# Altium schematic sheet AdjustableLDO.SchDoc
size A3; SheetNumber: 2; SheetTotal: 6
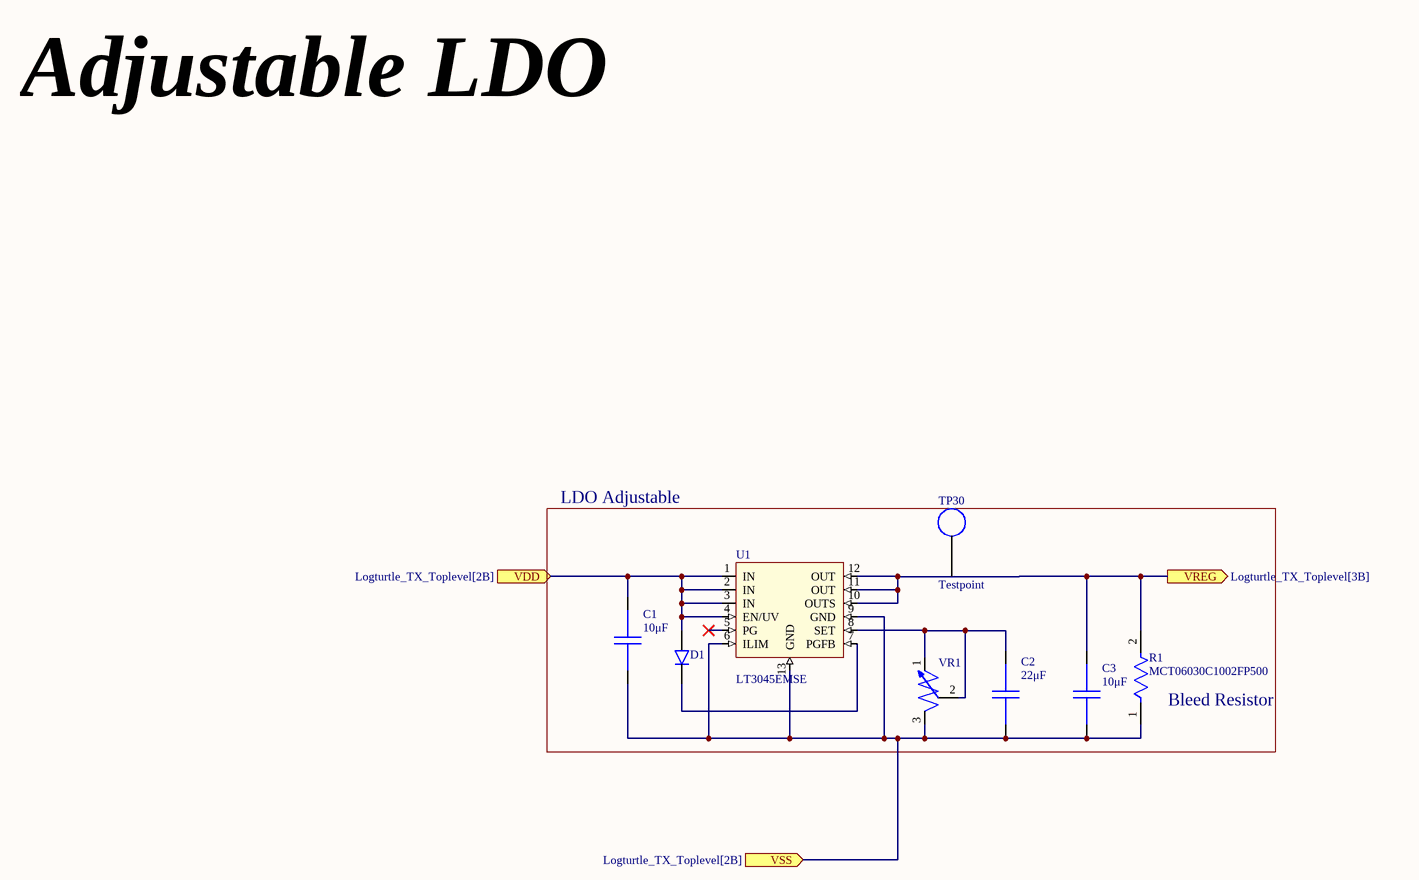
[diagram p0: AdjustableLDO.SchDoc]

## Parts
C1  10μF  [CAPC2012X14N]
C2  22μF  [CAPC3225X27N]
C3  10μF  [CAPC2012X14N]
D1  (no value)  [SODFL160X70-2N]
R1  MCT06030C1002FP500  [FP-MCT0603-IPC_C]
TP30  Testpoint  [TP_5006]
U1  LT3045EMSE  [TSOP65P490X110_HS-13N]
VR1  (no value)  [3296W]

## Ports
VDD (in, see Logturtle_TX_Toplevel[2B]), VREG (out, see Logturtle_TX_Toplevel[3B]), VSS (in, see Logturtle_TX_Toplevel[2B])

## Nets
VDD: C1.2 D1.1(Anode) U1.1(IN) U1.2(IN) U1.3(IN) U1.4(EN/UV) ; port VDD
VREG: C3.2 R1.2 TP30.1 U1.10(OUTS) U1.11(OUT) U1.12(OUT) ; port VREG
VSS: C1.1 C2.1 C3.1 R1.1 U1.6(ILIM) U1.9(GND) U1.13(GND) VR1.3 ; port VSS
NetC2_2: C2.2 U1.8(SET) VR1.1(CW) VR1.2(CCW)
NetD1_2: D1.2(Cathode) U1.7(PGFB)

Not connected (* = marked no-connect by the designer): U1 5(PG)*

## Notes on the sheet
- Adjustable LDO
- LDO Adjustable
- (near R1) Bleed Resistor

## Library data of the parts
C1 C3 = GRM21BZ71E106KE15L: Multilayer Ceramic Capacitor, 10 uF, 25 V, ï¿½ 10%, X7R, 0805 [2012 Metric] https://www.digikey.ie/en/products/detail/murata-electronics/GRM21BZ71E106KE15L/13904911; Manufacturer: Murata; Material: 4241ConductorMaterial; Value: 10uF; Voltage Rating: 25V; Supplier: Future Electronics; Supplier Part Number: 6134628; Manufacturer Part Number: GRM21BZ71E106KE15L; Category: Ceramic Capacitors; Stock: 81000; Case/Package: 339Case; Min Operating Temperature: -55°C; Max Operating Temperature: 125°C; Tolerance: 10%; Length: 2mm; Width: 1.25mm; Height: 1.45mm; Thickness: 1.25mm; RoHS Compliant: Yes; ComponentLink1URL: https://datasheet.octopart.com/GRM21BZ71E106KE15L-Murata-datasheet-141278873.pdf?src-supplier=Geoflip; ComponentLink1Description: https://datasheet.octopart.com/GRM21BZ71E106KE15L-Murata-datasheet-141278873.pdf?src-supplier=Geoflip; ComponentLink2URL: https://datasheet.octopart.com/GRM21BZ71E106KE15L-Murata-datasheet-165579666.pdf?src-supplier=TME; ComponentLink2Description: https://datasheet.octopart.com/GRM21BZ71E106KE15L-Murata-datasheet-165579666.pdf?src-supplier=TME; ComponentLink3URL: https://datasheet.octopart.com/GRM21BZ71E106KE15L-Murata-datasheet-140707837.pdf?src-supplier=Ciiva+Crawler; ComponentLink3Description: https://datasheet.octopart.com/GRM21BZ71E106KE15L-Murata-datasheet-140707837.pdf?src-supplier=Ciiva+Crawler; ComponentLink4URL: https://datasheet.octopart.com/GRM21BZ71E106KE15L-Murata-datasheet-138745134.pdf?src-supplier=Ciiva+Crawler; ComponentLink4Description: https://datasheet.octopart.com/GRM21BZ71E106KE15L-Murata-datasheet-138745134.pdf?src-supplier=Ciiva+Crawler
C2 = CC1210KKX7R7BB226: Ceramic Capacitor, Multilayer, Ceramic, 16V, 10% +Tol, 10% -Tol, X7R, 15% TC, 22uF, Surface Mount, 1210 https://www.digikey.ie/en/products/detail/yageo/CC1210KKX7R7BB226/5195434; Manufacturer: Yageo; Multilayer: Yes; Supplier: Rs; Supplier Part Number: 1992345; Manufacturer Part Number: CC1210KKX7R7BB226; RoHS: Yes; Category: Ceramic Capacitors; Stock: 1770; Pricing: 10=0.332, 100=0.248, 500=0.216, 1000=0.198 (EUR); Mounting Technology: Surface Mount; Pins: 2; Dielectric Material: Ceramic; Package Shape: Rectangular; Case/Package: 1210; Terminal Finish: Nickel; Min Operating Temperature: -55°C; Max Operating Temperature: 125°C; JESD-609 Code: e3; Value: 22uF; Capacitor Type: Ceramic; Tolerance  (fill in as +-): 10%; Package Style: SMTMeter; Packaging: Tape and Reel; Tolerance (fill in as +-): 10%; Rated DC Voltage (URdc): 16V; Temperature Characteristics Code: X7R; Termination: Wraparound; Length: 3.2mm; Width: 2.5mm; Height: 2.5mm; Reach SVHC Compliant: Yes; RoHS Compliant: Yes; ComponentLink1URL: https://datasheet.ciiva.com:443/pdfs/VipMasterIC/IC/YAGO/YAGO-S-A0003557223/YAGO-S-A0003557223-1.pdf?src-supplier=IHS+Markit; ComponentLink1Description: https://datasheet.ciiva.com:443/pdfs/VipMasterIC/IC/YAGO/YAGO-S-A0003557223/YAGO-S-A0003557223-1.pdf?src-supplier=IHS+Markit; ComponentLink2URL: https://datasheet.ciiva.com/11465/upy-gphc-x7r-6-3v-to-50v-8-11465512.pdf?src-supplier=Avnet; ComponentLink2Description: https://datasheet.ciiva.com/11465/upy-gphc-x7r-6-3v-to-50v-8-11465512.pdf?src-supplier=Avnet
D1 = 1N4148WT: Rectifier Diode, 1 Phase, 1 Element, 0.3A, 75V V(RRM), Silicon https://www.digikey.ie/en/products/detail/onsemi/1N4148WT/1954014; Manufacturer: ON Semiconductor / Fairchild; Supplier: Rs; Supplier Part Number: 7614283P; Manufacturer Part Number: 1N4148WT; RoHS: Yes; Category: Rectifier Diodes; Stock: 67900; Pricing: 500=0.029, 1000=0.025, 2500=0.022 (EUR); Diode Type: RECTIFIER; RoHS Compliant: Yes; ComponentLink1URL: https://datasheet.ciiva.com/16744/1n4148wt-16744972.pdf?src-supplier=Future+Electronics; ComponentLink1Description: https://datasheet.ciiva.com/16744/1n4148wt-16744972.pdf?src-supplier=Future+Electronics; ComponentLink2URL: https://datasheet.ciiva.com/30479/0900766b810e1cd4-30479226.pdf?src-supplier=Rs; ComponentLink2Description: https://datasheet.ciiva.com/30479/0900766b810e1cd4-30479226.pdf?src-supplier=Rs; ComponentLink3URL: https://datasheet.ciiva.com/15208/getdatasheetpartid-146392-15208359.pdf?src-supplier=Verical; ComponentLink3Description: https://datasheet.ciiva.com/15208/getdatasheetpartid-146392-15208359.pdf?src-supplier=Verical; ComponentLink4URL: https://datasheet.ciiva.com/916/1n914bwt-916865.pdf?src-supplier=Digikey; ComponentLink4Description: https://datasheet.ciiva.com/916/1n914bwt-916865.pdf?src-supplier=Digikey; ComponentLink5URL: https://datasheet.ciiva.com/916/1n914bwt-916866.pdf?src-supplier=Digikey; ComponentLink5Description: https://datasheet.ciiva.com/916/1n914bwt-916866.pdf?src-supplier=Digikey; ComponentLink6URL: https://datasheet.ciiva.com/916/1n914bwt-916864.pdf?src-supplier=Digikey; ComponentLink6Description: https://datasheet.ciiva.com/916/1n914bwt-916864.pdf?src-supplier=Digikey
R1 = CMP-02407-000418-1: RES SMD 100 OHM 1% 1/8W 0603; Voltage Rating: 75V; Power Rating: 100mW; Temperature Coefficient: 50ppm/°C; Max Power Dissipation: 125mW; Resistance: 10kR; Case/Package: 0603; Military Standard: Not; Min Operating Temperature: -55°C; Width: 0.8mm; Package Quantity: 1; Max Operating Temperature: 125°C; Tolerance: 1%; Depth: 0.85mm; Radiation Hardening: No; Mount: Surface Mount; Composition: Thin Film; Contact Plating: Tin; Lead Free: Lead Free; Case Code (Imperial): 0603; Number of Terminations: 2; Voltage Rating (DC): 75V; Length: 1.55mm; Packaging: Tape and Reel; Height: 0.022inch; Case Code (Metric): 1608
U1 = LT3045EMSE: 20V, 500mA, Ultralow Noise, Ultrahigh PSRR Linear Regulator  https://www.digikey.ie/en/products/detail/analog-devices-inc/LT3045EMSE-PBF/6234771
VR1 = 3296W-1-203LF: Trimmer, Cermet, 0.5W, 20000ohm, 300V, 10% +/-Tol, 100ppm/Cel, 25 Turn(s) https://www.bourns.com/docs/product-datasheets/3296.pdf; Manufacturer: Bourns; Actuator Orientation: Vertical; Actuator Type: SCREW; Number of Turns: 25; Power: 500mW; Rated Temperature: 70°C; Value: 20kR; Resistance Law: Linear; Rotational Angle: 9000°; Temperature Coefficient: -100100ppm/°C; Lead Diameter: 0.51mm; Lead Length: 6.4mm; Package Height: 10.03mm; Package Length: 9.53mm; Package Width: 4.83mm; Supplier: Digikey; Supplier Part Number: 3296W-203LF-ND; Manufacturer Part Number: 3296W-1-203LF; RoHS: Yes; Category: Variable Resistors and Potentiometers; Stock: 2018; Mounting Technology: Through Hole; Pins: 3; Package Shape: Rectangular; Case/Package: 3819; Terminal Finish: Tin; Min Operating Temperature: -55°C; Max Operating Temperature: 125°C; Tolerance: 10%; JESD-609 Code: e3; Resistor Type: TRIMMER; Construction: Trimmer Pot; Package Style: PCB MountMeter; Packaging: Rail/Tube; Technology: CERMET; Termination: Wire; RoHS Compliant: Yes; Reach SVHC Compliant: No; ComponentLink1URL: https://datasheet.ciiva.com:443/pdfs/VipMasterIC/IC/BOUR/BOUR-S-A0008796795/BOUR-S-A0008796795-1.pdf?src-supplier=IHS+Markit; ComponentLink1Description: https://datasheet.ciiva.com:443/pdfs/VipMasterIC/IC/BOUR/BOUR-S-A0008796795/BOUR-S-A0008796795-1.pdf?src-supplier=IHS+Markit; ComponentLink2URL: https://datasheet.ciiva.com/14173/ew3296-dat-e-14173023.pdf?src-supplier=Distrelec; ComponentLink2Description: https://datasheet.ciiva.com/14173/ew3296-dat-e-14173023.pdf?src-supplier=Distrelec; ComponentLink3URL: https://datasheet.ciiva.com/15156/getdatasheetpartid-62506-15156343.pdf?src-supplier=Verical; ComponentLink3Description: https://datasheet.ciiva.com/15156/getdatasheetpartid-62506-15156343.pdf?src-supplier=Verical